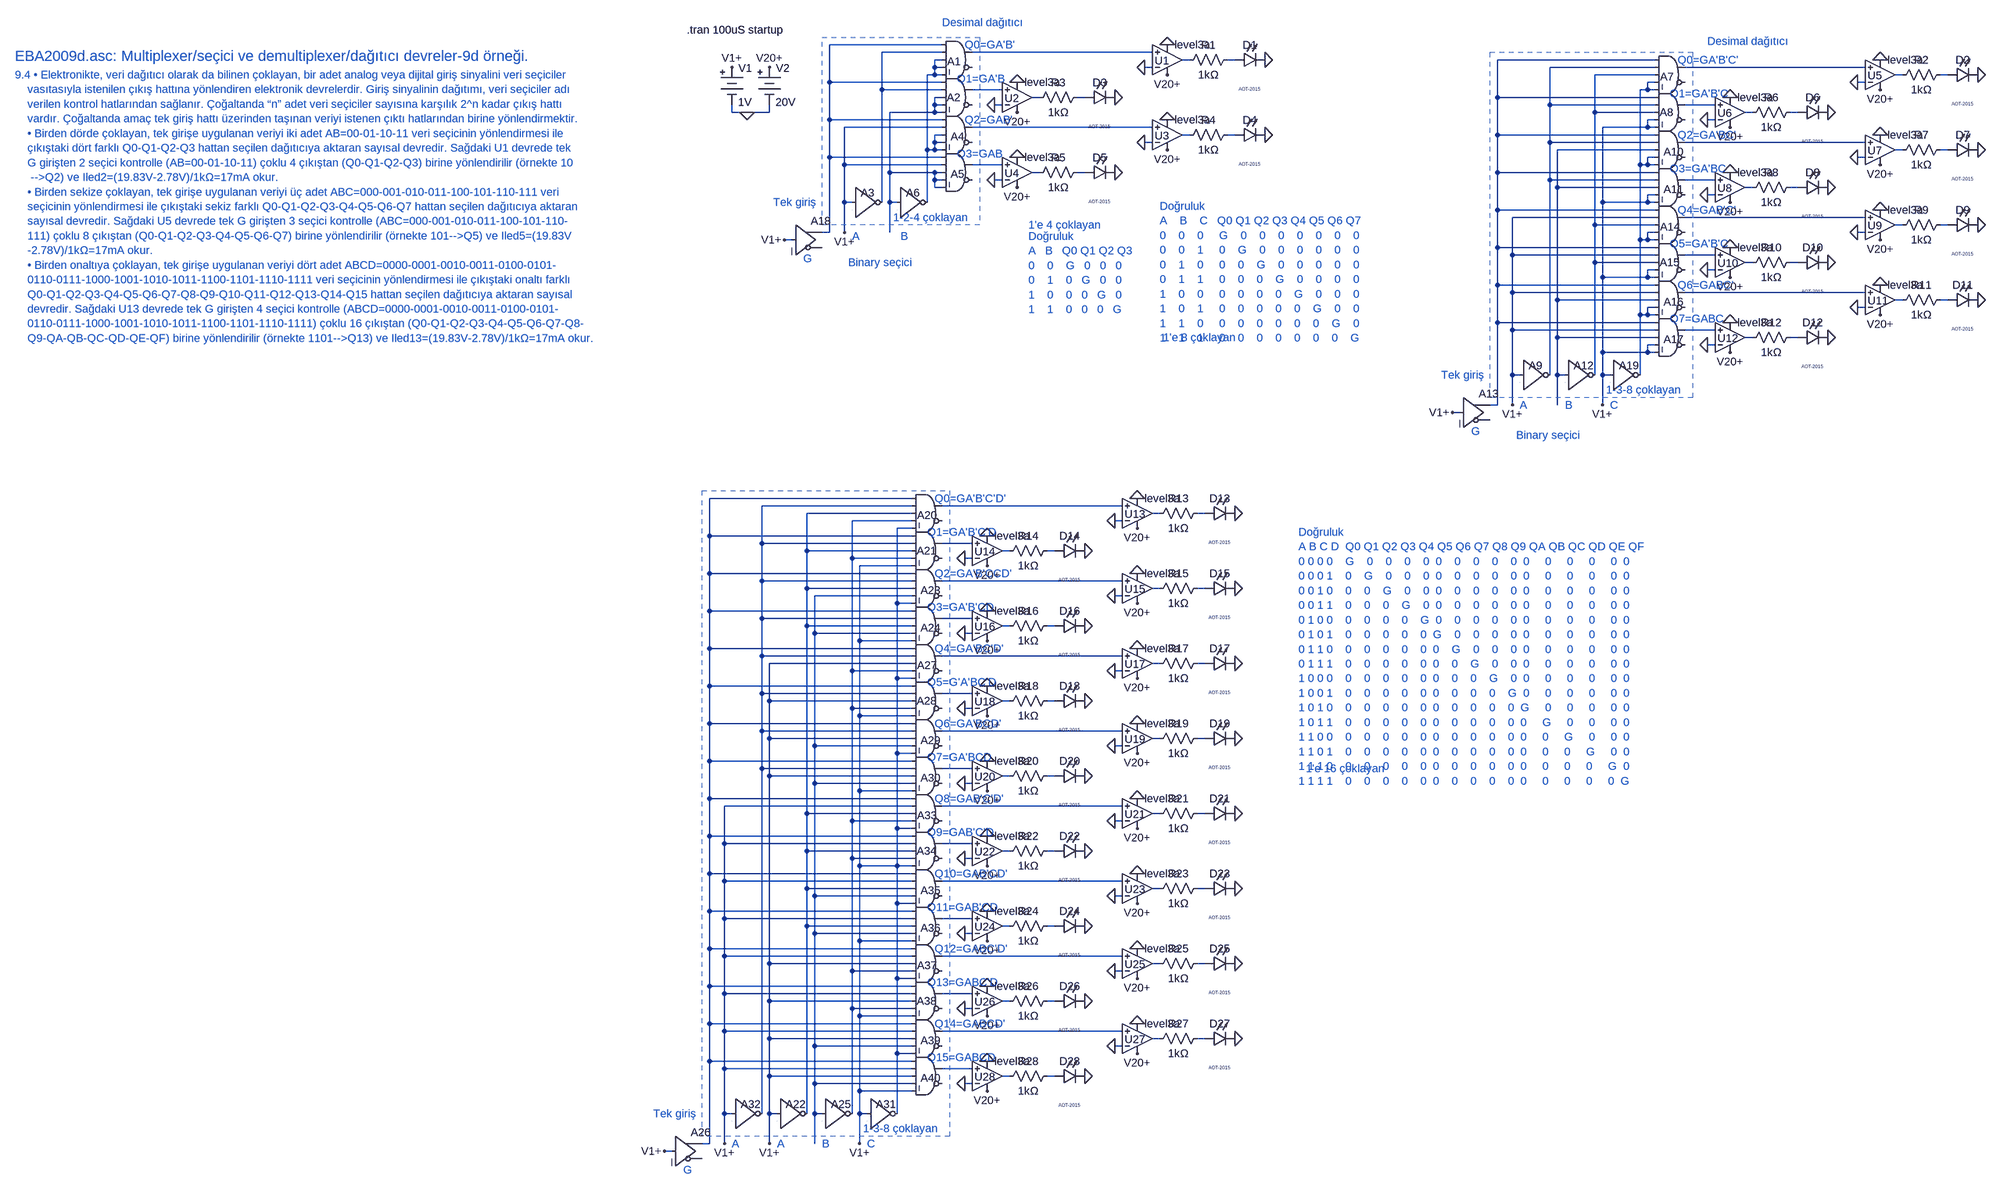
[diagram p0: schematic EBA2009d.asc]
EBA2009d.asc, the LTspice schematic file:
Version 4
SHEET 1 7064 4332
WIRE 1808 32 1568 32
WIRE 1808 48 1680 48
WIRE 2256 48 1872 48
WIRE 1808 64 1792 64
WIRE 2336 64 2320 64
WIRE 2432 64 2416 64
WIRE 3328 64 2992 64
WIRE 1792 80 1792 64
WIRE 1808 80 1792 80
WIRE 2256 80 2240 80
WIRE 3328 80 3104 80
WIRE 3776 80 3392 80
WIRE 1792 96 1792 80
WIRE 1792 96 1776 96
WIRE 1808 96 1792 96
WIRE 3328 96 3200 96
WIRE 3856 96 3840 96
WIRE 3952 96 3936 96
WIRE 1568 112 1568 32
WIRE 1808 112 1568 112
WIRE 3328 112 3312 112
WIRE 3776 112 3760 112
WIRE 1680 128 1680 48
WIRE 1808 128 1680 128
WIRE 1936 128 1872 128
WIRE 3312 128 3312 112
WIRE 3312 128 3296 128
WIRE 3328 128 3312 128
WIRE 1808 144 1792 144
WIRE 2016 144 2000 144
WIRE 2112 144 2096 144
WIRE 2992 144 2992 64
WIRE 3328 144 2992 144
WIRE 1792 160 1792 144
WIRE 1808 160 1792 160
WIRE 1936 160 1920 160
WIRE 3104 160 3104 80
WIRE 3328 160 3104 160
WIRE 3456 160 3392 160
WIRE 1360 176 1360 160
WIRE 1392 176 1360 176
WIRE 1440 176 1440 160
WIRE 1440 176 1392 176
WIRE 1792 176 1792 160
WIRE 1792 176 1696 176
WIRE 1808 176 1792 176
WIRE 3200 176 3200 96
WIRE 3328 176 3200 176
WIRE 3536 176 3520 176
WIRE 3632 176 3616 176
WIRE 1568 192 1568 112
WIRE 1808 192 1568 192
WIRE 3328 192 3312 192
WIRE 3456 192 3440 192
WIRE 1808 208 1600 208
WIRE 2256 208 1872 208
WIRE 3312 208 3312 192
WIRE 3312 208 3216 208
WIRE 3328 208 3312 208
WIRE 1808 224 1792 224
WIRE 2336 224 2320 224
WIRE 2432 224 2416 224
WIRE 2992 224 2992 144
WIRE 3328 224 2992 224
WIRE 1792 240 1792 224
WIRE 1808 240 1792 240
WIRE 2256 240 2240 240
WIRE 3104 240 3104 160
WIRE 3328 240 3104 240
WIRE 3776 240 3392 240
WIRE 1776 256 1776 96
WIRE 1792 256 1792 240
WIRE 1792 256 1776 256
WIRE 1808 256 1792 256
WIRE 3328 256 3120 256
WIRE 3856 256 3840 256
WIRE 3952 256 3936 256
WIRE 1568 272 1568 192
WIRE 1808 272 1568 272
WIRE 3328 272 3312 272
WIRE 3776 272 3760 272
WIRE 1600 288 1600 208
WIRE 1808 288 1600 288
WIRE 1936 288 1872 288
WIRE 3296 288 3296 128
WIRE 3312 288 3312 272
WIRE 3312 288 3296 288
WIRE 3328 288 3312 288
WIRE 1696 304 1696 176
WIRE 1792 304 1696 304
WIRE 1808 304 1792 304
WIRE 2016 304 2000 304
WIRE 2112 304 2096 304
WIRE 2992 304 2992 224
WIRE 3328 304 2992 304
WIRE 1792 320 1792 304
WIRE 1808 320 1792 320
WIRE 1936 320 1920 320
WIRE 3104 320 3104 240
WIRE 3328 320 3104 320
WIRE 3456 320 3392 320
WIRE 1792 336 1792 320
WIRE 1808 336 1792 336
WIRE 3120 336 3120 256
WIRE 3328 336 3120 336
WIRE 3536 336 3520 336
WIRE 3632 336 3616 336
WIRE 3328 352 3312 352
WIRE 3456 352 3440 352
WIRE 1600 368 1600 288
WIRE 1616 368 1600 368
WIRE 1680 368 1680 128
WIRE 1696 368 1696 304
WIRE 1712 368 1696 368
WIRE 1776 368 1776 256
WIRE 3216 368 3216 208
WIRE 3312 368 3312 352
WIRE 3312 368 3216 368
WIRE 3328 368 3312 368
WIRE 2992 384 2992 304
WIRE 3328 384 2992 384
WIRE 3328 400 3024 400
WIRE 3776 400 3392 400
WIRE 3200 416 3200 176
WIRE 3328 416 3200 416
WIRE 3856 416 3840 416
WIRE 3952 416 3936 416
WIRE 1568 432 1568 272
WIRE 1568 432 1552 432
WIRE 1600 432 1600 368
WIRE 1696 432 1696 368
WIRE 3328 432 3312 432
WIRE 3776 432 3760 432
WIRE 1488 448 1472 448
WIRE 3296 448 3296 288
WIRE 3312 448 3312 432
WIRE 3312 448 3296 448
WIRE 3328 448 3312 448
WIRE 2992 464 2992 384
WIRE 3328 464 2992 464
WIRE 3024 480 3024 400
WIRE 3328 480 3024 480
WIRE 3456 480 3392 480
WIRE 3200 496 3200 416
WIRE 3328 496 3200 496
WIRE 3536 496 3520 496
WIRE 3632 496 3616 496
WIRE 3328 512 3312 512
WIRE 3456 512 3440 512
WIRE 3216 528 3216 368
WIRE 3312 528 3312 512
WIRE 3312 528 3216 528
WIRE 3328 528 3312 528
WIRE 2992 544 2992 464
WIRE 3328 544 2992 544
WIRE 3024 560 3024 480
WIRE 3328 560 3024 560
WIRE 3776 560 3392 560
WIRE 3120 576 3120 336
WIRE 3328 576 3120 576
WIRE 3856 576 3840 576
WIRE 3952 576 3936 576
WIRE 3328 592 3312 592
WIRE 3776 592 3760 592
WIRE 3296 608 3296 448
WIRE 3312 608 3312 592
WIRE 3312 608 3296 608
WIRE 3328 608 3312 608
WIRE 2992 624 2992 544
WIRE 3328 624 2992 624
WIRE 3024 640 3024 560
WIRE 3328 640 3024 640
WIRE 3456 640 3392 640
WIRE 3120 656 3120 576
WIRE 3328 656 3120 656
WIRE 3536 656 3520 656
WIRE 3632 656 3616 656
WIRE 3328 672 3312 672
WIRE 3456 672 3440 672
WIRE 3216 688 3216 528
WIRE 3312 688 3312 672
WIRE 3312 688 3216 688
WIRE 3328 688 3312 688
WIRE 3024 736 3024 640
WIRE 3040 736 3024 736
WIRE 3104 736 3104 320
WIRE 3120 736 3120 656
WIRE 3136 736 3120 736
WIRE 3200 736 3200 496
WIRE 3216 736 3216 688
WIRE 3232 736 3216 736
WIRE 3296 736 3296 608
WIRE 2992 800 2992 624
WIRE 2992 800 2976 800
WIRE 3024 800 3024 736
WIRE 3120 800 3120 736
WIRE 3216 800 3216 736
WIRE 2912 816 2896 816
WIRE 1744 1024 1312 1024
WIRE 1744 1040 1424 1040
WIRE 2192 1040 1808 1040
WIRE 1744 1056 1520 1056
WIRE 2272 1056 2256 1056
WIRE 2368 1056 2352 1056
WIRE 1744 1072 1616 1072
WIRE 2192 1072 2176 1072
WIRE 1744 1088 1712 1088
WIRE 1312 1104 1312 1024
WIRE 1744 1104 1312 1104
WIRE 1424 1120 1424 1040
WIRE 1744 1120 1424 1120
WIRE 1872 1120 1808 1120
WIRE 1520 1136 1520 1056
WIRE 1744 1136 1520 1136
WIRE 1952 1136 1936 1136
WIRE 2048 1136 2032 1136
WIRE 1616 1152 1616 1072
WIRE 1744 1152 1616 1152
WIRE 1872 1152 1856 1152
WIRE 1744 1168 1632 1168
WIRE 1312 1184 1312 1104
WIRE 1744 1184 1312 1184
WIRE 1424 1200 1424 1120
WIRE 1744 1200 1424 1200
WIRE 2192 1200 1808 1200
WIRE 1520 1216 1520 1136
WIRE 1744 1216 1520 1216
WIRE 2272 1216 2256 1216
WIRE 2368 1216 2352 1216
WIRE 1744 1232 1536 1232
WIRE 2192 1232 2176 1232
WIRE 1712 1248 1712 1088
WIRE 1744 1248 1712 1248
WIRE 1312 1264 1312 1184
WIRE 1744 1264 1312 1264
WIRE 1424 1280 1424 1200
WIRE 1744 1280 1424 1280
WIRE 1872 1280 1808 1280
WIRE 1520 1296 1520 1216
WIRE 1744 1296 1520 1296
WIRE 1952 1296 1936 1296
WIRE 2048 1296 2032 1296
WIRE 1536 1312 1536 1232
WIRE 1744 1312 1536 1312
WIRE 1872 1312 1856 1312
WIRE 1632 1328 1632 1168
WIRE 1744 1328 1632 1328
WIRE 1312 1344 1312 1264
WIRE 1744 1344 1312 1344
WIRE 1424 1360 1424 1280
WIRE 1744 1360 1424 1360
WIRE 2192 1360 1808 1360
WIRE 1744 1376 1440 1376
WIRE 2272 1376 2256 1376
WIRE 2368 1376 2352 1376
WIRE 1616 1392 1616 1152
WIRE 1744 1392 1616 1392
WIRE 2192 1392 2176 1392
WIRE 1712 1408 1712 1248
WIRE 1744 1408 1712 1408
WIRE 1312 1424 1312 1344
WIRE 1744 1424 1312 1424
WIRE 1424 1440 1424 1360
WIRE 1744 1440 1424 1440
WIRE 1872 1440 1808 1440
WIRE 1440 1456 1440 1376
WIRE 1744 1456 1440 1456
WIRE 1952 1456 1936 1456
WIRE 2048 1456 2032 1456
WIRE 1616 1472 1616 1392
WIRE 1744 1472 1616 1472
WIRE 1872 1472 1856 1472
WIRE 1632 1488 1632 1328
WIRE 1744 1488 1632 1488
WIRE 1312 1504 1312 1424
WIRE 1744 1504 1312 1504
WIRE 1424 1520 1424 1440
WIRE 1744 1520 1424 1520
WIRE 2192 1520 1808 1520
WIRE 1440 1536 1440 1456
WIRE 1744 1536 1440 1536
WIRE 2272 1536 2256 1536
WIRE 2368 1536 2352 1536
WIRE 1536 1552 1536 1312
WIRE 1744 1552 1536 1552
WIRE 2192 1552 2176 1552
WIRE 1712 1568 1712 1408
WIRE 1744 1568 1712 1568
WIRE 1312 1584 1312 1504
WIRE 1744 1584 1312 1584
WIRE 1424 1600 1424 1520
WIRE 1744 1600 1424 1600
WIRE 1872 1600 1808 1600
WIRE 1440 1616 1440 1536
WIRE 1744 1616 1440 1616
WIRE 1952 1616 1936 1616
WIRE 2048 1616 2032 1616
WIRE 1536 1632 1536 1552
WIRE 1744 1632 1536 1632
WIRE 1872 1632 1856 1632
WIRE 1632 1648 1632 1488
WIRE 1744 1648 1632 1648
WIRE 1312 1664 1312 1584
WIRE 1744 1664 1312 1664
WIRE 1744 1680 1344 1680
WIRE 2192 1680 1808 1680
WIRE 1520 1696 1520 1296
WIRE 1744 1696 1520 1696
WIRE 2272 1696 2256 1696
WIRE 2368 1696 2352 1696
WIRE 1616 1712 1616 1472
WIRE 1744 1712 1616 1712
WIRE 2192 1712 2176 1712
WIRE 1712 1728 1712 1568
WIRE 1744 1728 1712 1728
WIRE 1312 1744 1312 1664
WIRE 1744 1744 1312 1744
WIRE 1344 1760 1344 1680
WIRE 1744 1760 1344 1760
WIRE 1872 1760 1808 1760
WIRE 1520 1776 1520 1696
WIRE 1744 1776 1520 1776
WIRE 1952 1776 1936 1776
WIRE 2048 1776 2032 1776
WIRE 1616 1792 1616 1712
WIRE 1744 1792 1616 1792
WIRE 1872 1792 1856 1792
WIRE 1632 1808 1632 1648
WIRE 1712 1808 1712 1728
WIRE 1712 1808 1632 1808
WIRE 1744 1808 1712 1808
WIRE 1312 1824 1312 1744
WIRE 1744 1824 1312 1824
WIRE 1344 1840 1344 1760
WIRE 1744 1840 1344 1840
WIRE 2192 1840 1808 1840
WIRE 1520 1856 1520 1776
WIRE 1744 1856 1520 1856
WIRE 2272 1856 2256 1856
WIRE 2368 1856 2352 1856
WIRE 1536 1872 1536 1632
WIRE 1744 1872 1536 1872
WIRE 2192 1872 2176 1872
WIRE 1712 1888 1712 1808
WIRE 1744 1888 1712 1888
WIRE 1312 1904 1312 1824
WIRE 1744 1904 1312 1904
WIRE 1344 1920 1344 1840
WIRE 1744 1920 1344 1920
WIRE 1872 1920 1808 1920
WIRE 1520 1936 1520 1856
WIRE 1744 1936 1520 1936
WIRE 1952 1936 1936 1936
WIRE 2048 1936 2032 1936
WIRE 1536 1952 1536 1872
WIRE 1744 1952 1536 1952
WIRE 1872 1952 1856 1952
WIRE 1632 1968 1632 1808
WIRE 1744 1968 1632 1968
WIRE 1312 1984 1312 1904
WIRE 1744 1984 1312 1984
WIRE 1344 2000 1344 1920
WIRE 1744 2000 1344 2000
WIRE 2192 2000 1808 2000
WIRE 1440 2016 1440 1616
WIRE 1744 2016 1440 2016
WIRE 2272 2016 2256 2016
WIRE 2368 2016 2352 2016
WIRE 1616 2032 1616 1792
WIRE 1744 2032 1616 2032
WIRE 2192 2032 2176 2032
WIRE 1712 2048 1712 1888
WIRE 1744 2048 1712 2048
WIRE 1312 2064 1312 1984
WIRE 1744 2064 1312 2064
WIRE 1344 2080 1344 2000
WIRE 1744 2080 1344 2080
WIRE 1872 2080 1808 2080
WIRE 1440 2096 1440 2016
WIRE 1744 2096 1440 2096
WIRE 1952 2096 1936 2096
WIRE 2048 2096 2032 2096
WIRE 1616 2112 1616 2032
WIRE 1744 2112 1616 2112
WIRE 1872 2112 1856 2112
WIRE 1632 2128 1632 1968
WIRE 1744 2128 1632 2128
WIRE 1312 2144 1312 2064
WIRE 1744 2144 1312 2144
WIRE 1344 2160 1344 2080
WIRE 1744 2160 1344 2160
WIRE 2192 2160 1808 2160
WIRE 1440 2176 1440 2096
WIRE 1744 2176 1440 2176
WIRE 2272 2176 2256 2176
WIRE 2368 2176 2352 2176
WIRE 1536 2192 1536 1952
WIRE 1744 2192 1536 2192
WIRE 2192 2192 2176 2192
WIRE 1712 2208 1712 2048
WIRE 1744 2208 1712 2208
WIRE 1312 2224 1312 2144
WIRE 1744 2224 1312 2224
WIRE 1344 2240 1344 2160
WIRE 1744 2240 1344 2240
WIRE 1872 2240 1808 2240
WIRE 1440 2256 1440 2176
WIRE 1744 2256 1440 2256
WIRE 1952 2256 1936 2256
WIRE 2048 2256 2032 2256
WIRE 1536 2272 1536 2192
WIRE 1744 2272 1536 2272
WIRE 1872 2272 1856 2272
WIRE 1632 2288 1632 2128
WIRE 1744 2288 1632 2288
WIRE 1344 2336 1344 2240
WIRE 1360 2336 1344 2336
WIRE 1424 2336 1424 1600
WIRE 1440 2336 1440 2256
WIRE 1456 2336 1440 2336
WIRE 1520 2336 1520 1936
WIRE 1536 2336 1536 2272
WIRE 1552 2336 1536 2336
WIRE 1616 2336 1616 2112
WIRE 1632 2336 1632 2288
WIRE 1648 2336 1632 2336
WIRE 1712 2336 1712 2208
WIRE 1312 2400 1312 2224
WIRE 1312 2400 1296 2400
WIRE 1344 2400 1344 2336
WIRE 1440 2400 1440 2336
WIRE 1536 2400 1536 2336
WIRE 1632 2400 1632 2336
WIRE 1232 2416 1216 2416
FLAG 2288 32 0
FLAG 2288 96 V20+
FLAG 2240 80 0
FLAG 2496 64 0
FLAG 1472 448 V1+
FLAG 1600 432 V1+
FLAG 1360 80 V1+
FLAG 1440 80 V20+
FLAG 1392 176 0
FLAG 1968 112 0
FLAG 1968 176 V20+
FLAG 1920 160 0
FLAG 2176 144 0
FLAG 2288 192 0
FLAG 2288 256 V20+
FLAG 2240 240 0
FLAG 2496 224 0
FLAG 1968 272 0
FLAG 1968 336 V20+
FLAG 1920 320 0
FLAG 2176 304 0
FLAG 3808 64 0
FLAG 3808 128 V20+
FLAG 3760 112 0
FLAG 4016 96 0
FLAG 2896 816 V1+
FLAG 3024 800 V1+
FLAG 3488 144 0
FLAG 3488 208 V20+
FLAG 3440 192 0
FLAG 3696 176 0
FLAG 3808 224 0
FLAG 3808 288 V20+
FLAG 3760 272 0
FLAG 4016 256 0
FLAG 3488 304 0
FLAG 3488 368 V20+
FLAG 3440 352 0
FLAG 3696 336 0
FLAG 3808 384 0
FLAG 3808 448 V20+
FLAG 3760 432 0
FLAG 4016 416 0
FLAG 3488 464 0
FLAG 3488 528 V20+
FLAG 3440 512 0
FLAG 3696 496 0
FLAG 3808 544 0
FLAG 3808 608 V20+
FLAG 3760 592 0
FLAG 4016 576 0
FLAG 3488 624 0
FLAG 3488 688 V20+
FLAG 3440 672 0
FLAG 3696 656 0
FLAG 3216 800 V1+
FLAG 2224 1024 0
FLAG 2224 1088 V20+
FLAG 2176 1072 0
FLAG 2432 1056 0
FLAG 1216 2416 V1+
FLAG 1440 2400 V1+
FLAG 1904 1104 0
FLAG 1904 1168 V20+
FLAG 1856 1152 0
FLAG 2112 1136 0
FLAG 2224 1184 0
FLAG 2224 1248 V20+
FLAG 2176 1232 0
FLAG 2432 1216 0
FLAG 1904 1264 0
FLAG 1904 1328 V20+
FLAG 1856 1312 0
FLAG 2112 1296 0
FLAG 2224 1344 0
FLAG 2224 1408 V20+
FLAG 2176 1392 0
FLAG 2432 1376 0
FLAG 1904 1424 0
FLAG 1904 1488 V20+
FLAG 1856 1472 0
FLAG 2112 1456 0
FLAG 2224 1504 0
FLAG 2224 1568 V20+
FLAG 2176 1552 0
FLAG 2432 1536 0
FLAG 1904 1584 0
FLAG 1904 1648 V20+
FLAG 1856 1632 0
FLAG 2112 1616 0
FLAG 1632 2400 V1+
FLAG 1344 2400 V1+
FLAG 2224 1664 0
FLAG 2224 1728 V20+
FLAG 2176 1712 0
FLAG 2432 1696 0
FLAG 1904 1744 0
FLAG 1904 1808 V20+
FLAG 1856 1792 0
FLAG 2112 1776 0
FLAG 2224 1824 0
FLAG 2224 1888 V20+
FLAG 2176 1872 0
FLAG 2432 1856 0
FLAG 1904 1904 0
FLAG 1904 1968 V20+
FLAG 1856 1952 0
FLAG 2112 1936 0
FLAG 2224 1984 0
FLAG 2224 2048 V20+
FLAG 2176 2032 0
FLAG 2432 2016 0
FLAG 1904 2064 0
FLAG 1904 2128 V20+
FLAG 1856 2112 0
FLAG 2112 2096 0
FLAG 2224 2144 0
FLAG 2224 2208 V20+
FLAG 2176 2192 0
FLAG 2432 2176 0
FLAG 1904 2224 0
FLAG 1904 2288 V20+
FLAG 1856 2272 0
FLAG 2112 2256 0
SYMBOL Digital\\and 1840 0 R0
WINDOW 0 -21 68 Left 2
SYMATTR InstName A1
SYMBOL Digital\\and 1840 80 R0
WINDOW 0 -22 64 Left 2
SYMATTR InstName A2
SYMBOL Digital\\inv 1616 304 R0
WINDOW 0 19 44 Left 2
SYMATTR InstName A3
SYMBOL Digital\\and 1840 160 R0
WINDOW 0 -14 68 Left 2
SYMATTR InstName A4
SYMBOL Digital\\and 1840 240 R0
WINDOW 0 -14 68 Left 2
SYMATTR InstName A5
SYMBOL Digital\\inv 1712 304 R0
WINDOW 0 19 44 Left 2
SYMATTR InstName A6
SYMBOL OpAmps\\UniversalOpAmp3 2288 64 M180
WINDOW 0 -27 -2 Left 2
SYMATTR InstName U1
SYMBOL res 2432 48 R90
WINDOW 0 0 56 VBottom 2
WINDOW 3 32 56 VTop 2
SYMATTR InstName R1
SYMATTR Value 1kΩ
SYMBOL LED 2432 48 M90
WINDOW 0 0 32 VBottom 2
WINDOW 3 72 32 VTop 0
SYMATTR InstName D1
SYMATTR Value AOT-2015
SYMATTR Description Diode
SYMATTR Type diode
SYMBOL Misc\\battery 1360 64 R0
WINDOW 0 14 18 Left 2
WINDOW 3 13 90 Left 2
SYMATTR InstName V1
SYMATTR Value 1V
SYMBOL Misc\\battery 1440 64 R0
WINDOW 0 14 18 Left 2
WINDOW 3 13 90 Left 2
SYMATTR InstName V2
SYMATTR Value 20V
SYMBOL OpAmps\\UniversalOpAmp3 1968 144 M180
WINDOW 0 -27 -2 Left 2
SYMATTR InstName U2
SYMBOL res 2112 128 R90
WINDOW 0 0 56 VBottom 2
WINDOW 3 32 56 VTop 2
SYMATTR InstName R3
SYMATTR Value 1kΩ
SYMBOL LED 2112 128 M90
WINDOW 0 0 32 VBottom 2
WINDOW 3 72 32 VTop 0
SYMATTR InstName D3
SYMATTR Value AOT-2015
SYMATTR Description Diode
SYMATTR Type diode
SYMBOL OpAmps\\UniversalOpAmp3 2288 224 M180
WINDOW 0 -27 -2 Left 2
SYMATTR InstName U3
SYMBOL res 2432 208 R90
WINDOW 0 0 56 VBottom 2
WINDOW 3 32 56 VTop 2
SYMATTR InstName R4
SYMATTR Value 1kΩ
SYMBOL LED 2432 208 M90
WINDOW 0 0 32 VBottom 2
WINDOW 3 72 32 VTop 0
SYMATTR InstName D4
SYMATTR Value AOT-2015
SYMATTR Description Diode
SYMATTR Type diode
SYMBOL OpAmps\\UniversalOpAmp3 1968 304 M180
WINDOW 0 -27 -2 Left 2
SYMATTR InstName U4
SYMBOL res 2112 288 R90
WINDOW 0 0 56 VBottom 2
WINDOW 3 32 56 VTop 2
SYMATTR InstName R5
SYMATTR Value 1kΩ
SYMBOL LED 2112 288 M90
WINDOW 0 0 32 VBottom 2
WINDOW 3 72 32 VTop 0
SYMATTR InstName D5
SYMATTR Value AOT-2015
SYMATTR Description Diode
SYMATTR Type diode
SYMBOL Digital\\buf 1488 384 R0
SYMATTR InstName A18
SYMBOL Digital\\and 3360 32 R0
WINDOW 0 -21 68 Left 2
SYMATTR InstName A7
SYMBOL Digital\\and 3360 112 R0
WINDOW 0 -22 64 Left 2
SYMATTR InstName A8
SYMBOL Digital\\inv 3040 672 R0
WINDOW 0 19 44 Left 2
SYMATTR InstName A9
SYMBOL Digital\\and 3360 192 R0
WINDOW 0 -14 68 Left 2
SYMATTR InstName A10
SYMBOL Digital\\and 3360 272 R0
WINDOW 0 -14 68 Left 2
SYMATTR InstName A11
SYMBOL Digital\\inv 3136 672 R0
WINDOW 0 19 44 Left 2
SYMATTR InstName A12
SYMBOL OpAmps\\UniversalOpAmp3 3808 96 M180
WINDOW 0 -27 -2 Left 2
SYMATTR InstName U5
SYMBOL res 3952 80 R90
WINDOW 0 0 56 VBottom 2
WINDOW 3 32 56 VTop 2
SYMATTR InstName R2
SYMATTR Value 1kΩ
SYMBOL LED 3952 80 M90
WINDOW 0 0 32 VBottom 2
WINDOW 3 72 32 VTop 0
SYMATTR InstName D2
SYMATTR Value AOT-2015
SYMATTR Description Diode
SYMATTR Type diode
SYMBOL OpAmps\\UniversalOpAmp3 3488 176 M180
WINDOW 0 -27 -2 Left 2
SYMATTR InstName U6
SYMBOL res 3632 160 R90
WINDOW 0 0 56 VBottom 2
WINDOW 3 32 56 VTop 2
SYMATTR InstName R6
SYMATTR Value 1kΩ
SYMBOL LED 3632 160 M90
WINDOW 0 0 32 VBottom 2
WINDOW 3 72 32 VTop 0
SYMATTR InstName D6
SYMATTR Value AOT-2015
SYMATTR Description Diode
SYMATTR Type diode
SYMBOL OpAmps\\UniversalOpAmp3 3808 256 M180
WINDOW 0 -27 -2 Left 2
SYMATTR InstName U7
SYMBOL res 3952 240 R90
WINDOW 0 0 56 VBottom 2
WINDOW 3 32 56 VTop 2
SYMATTR InstName R7
SYMATTR Value 1kΩ
SYMBOL LED 3952 240 M90
WINDOW 0 0 32 VBottom 2
WINDOW 3 72 32 VTop 0
SYMATTR InstName D7
SYMATTR Value AOT-2015
SYMATTR Description Diode
SYMATTR Type diode
SYMBOL OpAmps\\UniversalOpAmp3 3488 336 M180
WINDOW 0 -27 -2 Left 2
SYMATTR InstName U8
SYMBOL res 3632 320 R90
WINDOW 0 0 56 VBottom 2
WINDOW 3 32 56 VTop 2
SYMATTR InstName R8
SYMATTR Value 1kΩ
SYMBOL LED 3632 320 M90
WINDOW 0 0 32 VBottom 2
WINDOW 3 72 32 VTop 0
SYMATTR InstName D8
SYMATTR Value AOT-2015
SYMATTR Description Diode
SYMATTR Type diode
SYMBOL Digital\\buf 2912 752 R0
SYMATTR InstName A13
SYMBOL Digital\\and 3360 352 R0
WINDOW 0 -21 68 Left 2
SYMATTR InstName A14
SYMBOL Digital\\and 3360 432 R0
WINDOW 0 -22 64 Left 2
SYMATTR InstName A15
SYMBOL Digital\\and 3360 512 R0
WINDOW 0 -14 68 Left 2
SYMATTR InstName A16
SYMBOL Digital\\and 3360 592 R0
WINDOW 0 -14 68 Left 2
SYMATTR InstName A17
SYMBOL OpAmps\\UniversalOpAmp3 3808 416 M180
WINDOW 0 -27 -2 Left 2
SYMATTR InstName U9
SYMBOL res 3952 400 R90
WINDOW 0 0 56 VBottom 2
WINDOW 3 32 56 VTop 2
SYMATTR InstName R9
SYMATTR Value 1kΩ
SYMBOL LED 3952 400 M90
WINDOW 0 0 32 VBottom 2
WINDOW 3 72 32 VTop 0
SYMATTR InstName D9
SYMATTR Value AOT-2015
SYMATTR Description Diode
SYMATTR Type diode
SYMBOL OpAmps\\UniversalOpAmp3 3488 496 M180
WINDOW 0 -27 -2 Left 2
SYMATTR InstName U10
SYMBOL res 3632 480 R90
WINDOW 0 0 56 VBottom 2
WINDOW 3 32 56 VTop 2
SYMATTR InstName R10
SYMATTR Value 1kΩ
SYMBOL LED 3632 480 M90
WINDOW 0 0 32 VBottom 2
WINDOW 3 72 32 VTop 0
SYMATTR InstName D10
SYMATTR Value AOT-2015
SYMATTR Description Diode
SYMATTR Type diode
SYMBOL OpAmps\\UniversalOpAmp3 3808 576 M180
WINDOW 0 -27 -2 Left 2
SYMATTR InstName U11
SYMBOL res 3952 560 R90
WINDOW 0 0 56 VBottom 2
WINDOW 3 32 56 VTop 2
SYMATTR InstName R11
SYMATTR Value 1kΩ
SYMBOL LED 3952 560 M90
WINDOW 0 0 32 VBottom 2
WINDOW 3 72 32 VTop 0
SYMATTR InstName D11
SYMATTR Value AOT-2015
SYMATTR Description Diode
SYMATTR Type diode
SYMBOL OpAmps\\UniversalOpAmp3 3488 656 M180
WINDOW 0 -27 -2 Left 2
SYMATTR InstName U12
SYMBOL res 3632 640 R90
WINDOW 0 0 56 VBottom 2
WINDOW 3 32 56 VTop 2
SYMATTR InstName R12
SYMATTR Value 1kΩ
SYMBOL LED 3632 640 M90
WINDOW 0 0 32 VBottom 2
WINDOW 3 72 32 VTop 0
SYMATTR InstName D12
SYMATTR Value AOT-2015
SYMATTR Description Diode
SYMATTR Type diode
SYMBOL Digital\\inv 3232 672 R0
WINDOW 0 19 44 Left 2
SYMATTR InstName A19
SYMBOL Digital\\and 1776 992 R0
WINDOW 0 -21 68 Left 2
SYMATTR InstName A20
SYMBOL Digital\\and 1776 1072 R0
WINDOW 0 -22 64 Left 2
SYMATTR InstName A21
SYMBOL Digital\\inv 1456 2272 R0
WINDOW 0 19 44 Left 2
SYMATTR InstName A22
SYMBOL Digital\\and 1776 1152 R0
WINDOW 0 -14 68 Left 2
SYMATTR InstName A23
SYMBOL Digital\\and 1776 1232 R0
WINDOW 0 -14 68 Left 2
SYMATTR InstName A24
SYMBOL Digital\\inv 1552 2272 R0
WINDOW 0 19 44 Left 2
SYMATTR InstName A25
SYMBOL OpAmps\\UniversalOpAmp3 2224 1056 M180
WINDOW 0 -27 -2 Left 2
SYMATTR InstName U13
SYMBOL res 2368 1040 R90
WINDOW 0 0 56 VBottom 2
WINDOW 3 32 56 VTop 2
SYMATTR InstName R13
SYMATTR Value 1kΩ
SYMBOL LED 2368 1040 M90
WINDOW 0 0 32 VBottom 2
WINDOW 3 72 32 VTop 0
SYMATTR InstName D13
SYMATTR Value AOT-2015
SYMATTR Description Diode
SYMATTR Type diode
SYMBOL OpAmps\\UniversalOpAmp3 1904 1136 M180
WINDOW 0 -27 -2 Left 2
SYMATTR InstName U14
SYMBOL res 2048 1120 R90
WINDOW 0 0 56 VBottom 2
WINDOW 3 32 56 VTop 2
SYMATTR InstName R14
SYMATTR Value 1kΩ
SYMBOL LED 2048 1120 M90
WINDOW 0 0 32 VBottom 2
WINDOW 3 72 32 VTop 0
SYMATTR InstName D14
SYMATTR Value AOT-2015
SYMATTR Description Diode
SYMATTR Type diode
SYMBOL OpAmps\\UniversalOpAmp3 2224 1216 M180
WINDOW 0 -27 -2 Left 2
SYMATTR InstName U15
SYMBOL res 2368 1200 R90
WINDOW 0 0 56 VBottom 2
WINDOW 3 32 56 VTop 2
SYMATTR InstName R15
SYMATTR Value 1kΩ
SYMBOL LED 2368 1200 M90
WINDOW 0 0 32 VBottom 2
WINDOW 3 72 32 VTop 0
SYMATTR InstName D15
SYMATTR Value AOT-2015
SYMATTR Description Diode
SYMATTR Type diode
SYMBOL OpAmps\\UniversalOpAmp3 1904 1296 M180
WINDOW 0 -27 -2 Left 2
SYMATTR InstName U16
SYMBOL res 2048 1280 R90
WINDOW 0 0 56 VBottom 2
WINDOW 3 32 56 VTop 2
SYMATTR InstName R16
SYMATTR Value 1kΩ
SYMBOL LED 2048 1280 M90
WINDOW 0 0 32 VBottom 2
WINDOW 3 72 32 VTop 0
SYMATTR InstName D16
SYMATTR Value AOT-2015
SYMATTR Description Diode
SYMATTR Type diode
SYMBOL Digital\\buf 1232 2352 R0
SYMATTR InstName A26
SYMBOL Digital\\and 1776 1312 R0
WINDOW 0 -21 68 Left 2
SYMATTR InstName A27
SYMBOL Digital\\and 1776 1392 R0
WINDOW 0 -22 64 Left 2
SYMATTR InstName A28
SYMBOL Digital\\and 1776 1472 R0
WINDOW 0 -14 68 Left 2
SYMATTR InstName A29
SYMBOL Digital\\and 1776 1552 R0
WINDOW 0 -14 68 Left 2
SYMATTR InstName A30
SYMBOL OpAmps\\UniversalOpAmp3 2224 1376 M180
WINDOW 0 -27 -2 Left 2
SYMATTR InstName U17
SYMBOL res 2368 1360 R90
WINDOW 0 0 56 VBottom 2
WINDOW 3 32 56 VTop 2
SYMATTR InstName R17
SYMATTR Value 1kΩ
SYMBOL LED 2368 1360 M90
WINDOW 0 0 32 VBottom 2
WINDOW 3 72 32 VTop 0
SYMATTR InstName D17
SYMATTR Value AOT-2015
SYMATTR Description Diode
SYMATTR Type diode
SYMBOL OpAmps\\UniversalOpAmp3 1904 1456 M180
WINDOW 0 -27 -2 Left 2
SYMATTR InstName U18
SYMBOL res 2048 1440 R90
WINDOW 0 0 56 VBottom 2
WINDOW 3 32 56 VTop 2
SYMATTR InstName R18
SYMATTR Value 1kΩ
SYMBOL LED 2048 1440 M90
WINDOW 0 0 32 VBottom 2
WINDOW 3 72 32 VTop 0
SYMATTR InstName D18
SYMATTR Value AOT-2015
SYMATTR Description Diode
SYMATTR Type diode
SYMBOL OpAmps\\UniversalOpAmp3 2224 1536 M180
WINDOW 0 -27 -2 Left 2
SYMATTR InstName U19
SYMBOL res 2368 1520 R90
WINDOW 0 0 56 VBottom 2
WINDOW 3 32 56 VTop 2
SYMATTR InstName R19
SYMATTR Value 1kΩ
SYMBOL LED 2368 1520 M90
WINDOW 0 0 32 VBottom 2
WINDOW 3 72 32 VTop 0
SYMATTR InstName D19
SYMATTR Value AOT-2015
SYMATTR Description Diode
SYMATTR Type diode
SYMBOL OpAmps\\UniversalOpAmp3 1904 1616 M180
WINDOW 0 -27 -2 Left 2
SYMATTR InstName U20
SYMBOL res 2048 1600 R90
WINDOW 0 0 56 VBottom 2
WINDOW 3 32 56 VTop 2
SYMATTR InstName R20
SYMATTR Value 1kΩ
SYMBOL LED 2048 1600 M90
WINDOW 0 0 32 VBottom 2
WINDOW 3 72 32 VTop 0
SYMATTR InstName D20
SYMATTR Value AOT-2015
SYMATTR Description Diode
SYMATTR Type diode
SYMBOL Digital\\inv 1648 2272 R0
WINDOW 0 19 44 Left 2
SYMATTR InstName A31
SYMBOL Digital\\inv 1360 2272 R0
WINDOW 0 19 44 Left 2
SYMATTR InstName A32
SYMBOL Digital\\and 1776 1632 R0
WINDOW 0 -21 68 Left 2
SYMATTR InstName A33
SYMBOL Digital\\and 1776 1712 R0
WINDOW 0 -22 64 Left 2
SYMATTR InstName A34
SYMBOL Digital\\and 1776 1792 R0
WINDOW 0 -14 68 Left 2
SYMATTR InstName A35
SYMBOL Digital\\and 1776 1872 R0
WINDOW 0 -14 68 Left 2
SYMATTR InstName A36
SYMBOL OpAmps\\UniversalOpAmp3 2224 1696 M180
WINDOW 0 -27 -2 Left 2
SYMATTR InstName U21
SYMBOL res 2368 1680 R90
WINDOW 0 0 56 VBottom 2
WINDOW 3 32 56 VTop 2
SYMATTR InstName R21
SYMATTR Value 1kΩ
SYMBOL LED 2368 1680 M90
WINDOW 0 0 32 VBottom 2
WINDOW 3 72 32 VTop 0
SYMATTR InstName D21
SYMATTR Value AOT-2015
SYMATTR Description Diode
SYMATTR Type diode
SYMBOL OpAmps\\UniversalOpAmp3 1904 1776 M180
WINDOW 0 -27 -2 Left 2
SYMATTR InstName U22
SYMBOL res 2048 1760 R90
WINDOW 0 0 56 VBottom 2
WINDOW 3 32 56 VTop 2
SYMATTR InstName R22
SYMATTR Value 1kΩ
SYMBOL LED 2048 1760 M90
WINDOW 0 0 32 VBottom 2
WINDOW 3 72 32 VTop 0
SYMATTR InstName D22
SYMATTR Value AOT-2015
SYMATTR Description Diode
SYMATTR Type diode
SYMBOL OpAmps\\UniversalOpAmp3 2224 1856 M180
WINDOW 0 -27 -2 Left 2
SYMATTR InstName U23
SYMBOL res 2368 1840 R90
WINDOW 0 0 56 VBottom 2
WINDOW 3 32 56 VTop 2
SYMATTR InstName R23
SYMATTR Value 1kΩ
SYMBOL LED 2368 1840 M90
WINDOW 0 0 32 VBottom 2
WINDOW 3 72 32 VTop 0
SYMATTR InstName D23
SYMATTR Value AOT-2015
SYMATTR Description Diode
SYMATTR Type diode
SYMBOL OpAmps\\UniversalOpAmp3 1904 1936 M180
WINDOW 0 -27 -2 Left 2
SYMATTR InstName U24
SYMBOL res 2048 1920 R90
WINDOW 0 0 56 VBottom 2
WINDOW 3 32 56 VTop 2
SYMATTR InstName R24
SYMATTR Value 1kΩ
SYMBOL LED 2048 1920 M90
WINDOW 0 0 32 VBottom 2
WINDOW 3 72 32 VTop 0
SYMATTR InstName D24
SYMATTR Value AOT-2015
SYMATTR Description Diode
SYMATTR Type diode
SYMBOL Digital\\and 1776 1952 R0
WINDOW 0 -21 68 Left 2
SYMATTR InstName A37
SYMBOL Digital\\and 1776 2032 R0
WINDOW 0 -22 64 Left 2
SYMATTR InstName A38
SYMBOL Digital\\and 1776 2112 R0
WINDOW 0 -14 68 Left 2
SYMATTR InstName A39
SYMBOL Digital\\and 1776 2192 R0
WINDOW 0 -14 68 Left 2
SYMATTR InstName A40
SYMBOL OpAmps\\UniversalOpAmp3 2224 2016 M180
WINDOW 0 -27 -2 Left 2
SYMATTR InstName U25
SYMBOL res 2368 2000 R90
WINDOW 0 0 56 VBottom 2
WINDOW 3 32 56 VTop 2
SYMATTR InstName R25
SYMATTR Value 1kΩ
SYMBOL LED 2368 2000 M90
WINDOW 0 0 32 VBottom 2
WINDOW 3 72 32 VTop 0
SYMATTR InstName D25
SYMATTR Value AOT-2015
SYMATTR Description Diode
SYMATTR Type diode
SYMBOL OpAmps\\UniversalOpAmp3 1904 2096 M180
WINDOW 0 -27 -2 Left 2
SYMATTR InstName U26
SYMBOL res 2048 2080 R90
WINDOW 0 0 56 VBottom 2
WINDOW 3 32 56 VTop 2
SYMATTR InstName R26
SYMATTR Value 1kΩ
SYMBOL LED 2048 2080 M90
WINDOW 0 0 32 VBottom 2
WINDOW 3 72 32 VTop 0
SYMATTR InstName D26
SYMATTR Value AOT-2015
SYMATTR Description Diode
SYMATTR Type diode
SYMBOL OpAmps\\UniversalOpAmp3 2224 2176 M180
WINDOW 0 -27 -2 Left 2
SYMATTR InstName U27
SYMBOL res 2368 2160 R90
WINDOW 0 0 56 VBottom 2
WINDOW 3 32 56 VTop 2
SYMATTR InstName R27
SYMATTR Value 1kΩ
SYMBOL LED 2368 2160 M90
WINDOW 0 0 32 VBottom 2
WINDOW 3 72 32 VTop 0
SYMATTR InstName D27
SYMATTR Value AOT-2015
SYMATTR Description Diode
SYMATTR Type diode
SYMBOL OpAmps\\UniversalOpAmp3 1904 2256 M180
WINDOW 0 -27 -2 Left 2
SYMATTR InstName U28
SYMBOL res 2048 2240 R90
WINDOW 0 0 56 VBottom 2
WINDOW 3 32 56 VTop 2
SYMATTR InstName R28
SYMATTR Value 1kΩ
SYMBOL LED 2048 2240 M90
WINDOW 0 0 32 VBottom 2
WINDOW 3 72 32 VTop 0
SYMATTR InstName D28
SYMATTR Value AOT-2015
SYMATTR Description Diode
SYMATTR Type diode
TEXT -232 56 Left 3 ;EBA2009d.asc: Multiplexer/seçici ve demultiplexer/dağıtıcı devreler-9d örneği.
TEXT -232 96 Left 2 ;9.4 • Elektronikte, veri dağıtıcı olarak da bilinen çoklayan, bir adet analog veya dijital giriş sinyalini veri seçiciler \n    vasıtasıyla istenilen çıkış hattına yönlendiren elektronik devrelerdir. Giriş sinyalinin dağıtımı, veri seçiciler adı\n    verilen kontrol hatlarından sağlanır. Çoğaltanda “n” adet veri seçiciler sayısına karşılık 2^n kadar çıkış hattı \n    vardır. Çoğaltanda amaç tek giriş hattı üzerinden taşınan veriyi istenen çıktı hatlarından birine yönlendirmektir.\n    • Birden dörde çoklayan, tek girişe uygulanan veriyi iki adet AB=00-01-10-11 veri seçicinin yönlendirmesi ile \n    çıkıştaki dört farklı Q0-Q1-Q2-Q3 hattan seçilen dağıtıcıya aktaran sayısal devredir. Sağdaki U1 devrede tek\n    G girişten 2 seçici kontrolle (AB=00-01-10-11) çoklu 4 çıkıştan (Q0-Q1-Q2-Q3) birine yönlendirilir (örnekte 10\n     -->Q2) ve Iled2=(19.83V-2.78V)/1kΩ=17mA okur.\n    • Birden sekize çoklayan, tek girişe uygulanan veriyi üç adet ABC=000-001-010-011-100-101-110-111 veri \n    seçicinin yönlendirmesi ile çıkıştaki sekiz farklı Q0-Q1-Q2-Q3-Q4-Q5-Q6-Q7 hattan seçilen dağıtıcıya aktaran \n    sayısal devredir. Sağdaki U5 devrede tek G girişten 3 seçici kontrolle (ABC=000-001-010-011-100-101-110-\n    111) çoklu 8 çıkıştan (Q0-Q1-Q2-Q3-Q4-Q5-Q6-Q7) birine yönlendirilir (örnekte 101-->Q5) ve Iled5=(19.83V\n    -2.78V)/1kΩ=17mA okur.\n    • Birden onaltıya çoklayan, tek girişe uygulanan veriyi dört adet ABCD=0000-0001-0010-0011-0100-0101-\n    0110-0111-1000-1001-1010-1011-1100-1101-1110-1111 veri seçicinin yönlendirmesi ile çıkıştaki onaltı farklı\n    Q0-Q1-Q2-Q3-Q4-Q5-Q6-Q7-Q8-Q9-Q10-Q11-Q12-Q13-Q14-Q15 hattan seçilen dağıtıcıya aktaran sayısal \n    devredir. Sağdaki U13 devrede tek G girişten 4 seçici kontrolle (ABCD=0000-0001-0010-0011-0100-0101-\n    0110-0111-1000-1001-1010-1011-1100-1101-1110-1111) çoklu 16 çıkıştan (Q0-Q1-Q2-Q3-Q4-Q5-Q6-Q7-Q8-\n    Q9-QA-QB-QC-QD-QE-QF) birine yönlendirilir (örnekte 1101-->Q13) ve Iled13=(19.83V-2.78V)/1kΩ=17mA okur.
TEXT 1992 416 Left 2 ;1'e 4 çoklayan
TEXT 1992 440 Left 2 ;Doğruluk\nA   B   Q0 Q1 Q2 Q3\n0    0    G   0   0   0\n0    1    0   G   0   0\n1    0    0   0   G   0\n1    1    0   0   0   G
TEXT 1616 440 Left 2 ;A
TEXT 1704 400 Left 2 ;1-2-4 çoklayan
TEXT 1720 440 Left 2 ;B
TEXT 1512 488 Left 2 ;G
TEXT 1840 264 Left 2 ;Q3=GAB
TEXT 1856 192 Left 2 ;Q2=GAB'
TEXT 1840 104 Left 2 ;Q1=GA'B
TEXT 1856 32 Left 2 ;Q0=GA'B'
TEXT 2280 656 Left 2 ;1'e 8 çoklayan
TEXT 2272 376 Left 2 ;Doğruluk\nA    B    C   Q0 Q1 Q2 Q3 Q4 Q5 Q6 Q7\n0    0    0     G    0    0    0    0    0    0    0\n0    0    1     0    G    0    0    0    0    0    0\n0    1    0     0    0    G    0    0    0    0    0\n0    1    1     0    0    0    G    0    0    0    0\n1    0    0     0    0    0    0    G    0    0    0\n1    0    1     0    0    0    0    0    G    0    0\n1    1    0     0    0    0    0    0    0    G    0\n1    1    1     0    0    0    0    0    0    0    G
TEXT 1608 496 Left 2 ;Binary seçici
TEXT 1808 -16 Left 2 ;Desimal dağıtıcı
TEXT 1448 368 Left 2 ;Tek giriş
TEXT 1264 0 Left 2 !.tran 100uS startup
TEXT 3040 800 Left 2 ;A
TEXT 3224 768 Left 2 ;1-3-8 çoklayan
TEXT 3136 800 Left 2 ;B
TEXT 2936 856 Left 2 ;G
TEXT 3360 296 Left 2 ;Q3=GA'BC
TEXT 3376 224 Left 2 ;Q2=GA'BC'
TEXT 3360 136 Left 2 ;Q1=GA'B'C
TEXT 3376 64 Left 2 ;Q0=GA'B'C'
TEXT 3032 864 Left 2 ;Binary seçici
TEXT 3440 24 Left 2 ;Desimal dağıtıcı
TEXT 2872 736 Left 2 ;Tek giriş
TEXT 3360 616 Left 2 ;Q7=GABC
TEXT 3376 544 Left 2 ;Q6=GABC'
TEXT 3360 456 Left 2 ;Q5=GA'B'C
TEXT 3376 384 Left 2 ;Q4=GAB'C'
TEXT 3232 800 Left 2 ;C
TEXT 1456 2400 Left 2 ;A
TEXT 1640 2368 Left 2 ;1-3-8 çoklayan
TEXT 1552 2400 Left 2 ;B
TEXT 1256 2456 Left 2 ;G
TEXT 1776 1256 Left 2 ;Q3=GA'B'CD
TEXT 1792 1184 Left 2 ;Q2=GA'B'CCD'
TEXT 1776 1096 Left 2 ;Q1=GA'B'C'D
TEXT 1792 1024 Left 2 ;Q0=GA'B'C'D'
TEXT 1192 2336 Left 2 ;Tek giriş
TEXT 1776 1576 Left 2 ;Q7=GA'BCD
TEXT 1792 1504 Left 2 ;Q6=GA'BCD'
TEXT 1776 1416 Left 2 ;Q5=G'A'BC'D
TEXT 1792 1344 Left 2 ;Q4=GA'BC'D'
TEXT 1648 2400 Left 2 ;C
TEXT 2584 1600 Left 2 ;1'e 16 çoklayan
TEXT 2568 1096 Left 2 ;Doğruluk\nA B C D  Q0 Q1 Q2 Q3 Q4 Q5 Q6 Q7 Q8 Q9 QA QB QC QD QE QF\n0 0 0 0    G    0    0    0    0  0    0    0    0    0  0     0     0     0     0  0\n0 0 0 1    0    G    0    0    0  0    0    0    0    0  0     0     0     0     0  0\n0 0 1 0    0    0    G    0    0  0    0    0    0    0  0     0     0     0     0  0\n0 0 1 1    0    0    0    G    0  0    0    0    0    0  0     0     0     0     0  0\n0 1 0 0    0    0    0    0    G  0    0    0    0    0  0     0     0     0     0  0\n0 1 0 1    0    0    0    0    0  G    0    0    0    0  0     0     0     0     0  0\n0 1 1 0    0    0    0    0    0  0    G    0    0    0  0     0     0     0     0  0\n0 1 1 1    0    0    0    0    0  0    0    G    0    0  0     0     0     0     0  0\n1 0 0 0    0    0    0    0    0  0    0    0    G    0  0     0     0     0     0  0\n1 0 0 1    0    0    0    0    0  0    0    0    0    G  0     0     0     0     0  0\n1 0 1 0    0    0    0    0    0  0    0    0    0    0  G     0     0     0     0  0\n1 0 1 1    0    0    0    0    0  0    0    0    0    0  0     G     0     0     0  0\n1 1 0 0    0    0    0    0    0  0    0    0    0    0  0     0     G     0     0  0\n1 1 0 1    0    0    0    0    0  0    0    0    0    0  0     0     0     G     0  0\n1 1 1 0    0    0    0    0    0  0    0    0    0    0  0     0     0     0     G  0\n1 1 1 1    0    0    0    0    0  0    0    0    0    0  0     0     0     0     0  G
TEXT 1360 2400 Left 2 ;A
TEXT 1776 1896 Left 2 ;Q11=GAB'CD
TEXT 1792 1824 Left 2 ;Q10=GAB'CD'
TEXT 1776 1736 Left 2 ;Q9=GAB'C'D
TEXT 1792 1664 Left 2 ;Q8=GAB'C'D'
TEXT 1776 2216 Left 2 ;Q15=GABCD
TEXT 1792 2144 Left 2 ;Q14=GABCD'
TEXT 1776 2056 Left 2 ;Q13=GABC'D
TEXT 1792 1984 Left 2 ;Q12=GABC'D'
RECTANGLE Normal 1888 416 1552 16 2
RECTANGLE Normal 3408 784 2976 48 2
RECTANGLE Normal 1824 2384 1296 1008 2

The netlist it stands for:
* EBA2009d.asc
A1 N001 N002 N004 N004 N004 0 N003 0 AND
A2 N001 N002 N015 N015 N015 0 N014 0 AND
A3 V1+ 0 0 0 0 N002 0 0 BUF
A4 N001 V1+ N004 N004 N004 0 N021 0 AND
A5 N001 V1+ N015 N015 N015 0 N028 0 AND
A6 N015 0 0 0 0 N004 0 0 BUF
XU1 N003 0 V20+ 0 N005 level3a  ; pins In+ In- V+ V- OUT
R1 N006 N005 1kΩ
D1 N006 0 AOT-2015
V1 V1+ 0 1V
V2 V20+ 0 20V
XU2 N014 0 V20+ 0 N016 level3a  ; pins In+ In- V+ V- OUT
R3 N017 N016 1kΩ
D3 N017 0 AOT-2015
XU3 N021 0 V20+ 0 N022 level3a  ; pins In+ In- V+ V- OUT
R4 N023 N022 1kΩ
D4 N023 0 AOT-2015
XU4 N028 0 V20+ 0 N029 level3a  ; pins In+ In- V+ V- OUT
R5 N030 N029 1kΩ
D5 N030 0 AOT-2015
A18 V1+ 0 0 0 0 0 N001 0 BUF
A7 N007 N008 N010 N013 N013 0 N009 0 AND
A8 N007 N008 N010 V1+ V1+ 0 N018 0 AND
A9 V1+ 0 0 0 0 N008 0 0 BUF
A10 N007 N008 N025 N013 N013 0 N024 0 AND
A11 N007 N008 N025 V1+ V1+ 0 N031 0 AND
A12 N025 0 0 0 0 N010 0 0 BUF
XU5 N009 0 V20+ 0 N011 level3a  ; pins In+ In- V+ V- OUT
R2 N012 N011 1kΩ
D2 N012 0 AOT-2015
XU6 N018 0 V20+ 0 N019 level3a  ; pins In+ In- V+ V- OUT
R6 N020 N019 1kΩ
D6 N020 0 AOT-2015
XU7 N024 0 V20+ 0 N026 level3a  ; pins In+ In- V+ V- OUT
R7 N027 N026 1kΩ
D7 N027 0 AOT-2015
XU8 N031 0 V20+ 0 N032 level3a  ; pins In+ In- V+ V- OUT
R8 N033 N032 1kΩ
D8 N033 0 AOT-2015
A13 V1+ 0 0 0 0 0 N007 0 BUF
A14 N007 V1+ N010 N013 N013 0 N034 0 AND
A15 N007 V1+ N010 V1+ V1+ 0 N037 0 AND
A16 N007 V1+ N025 N013 N013 0 N040 0 AND
A17 N007 V1+ N025 V1+ V1+ 0 N043 0 AND
XU9 N034 0 V20+ 0 N035 level3a  ; pins In+ In- V+ V- OUT
R9 N036 N035 1kΩ
D9 N036 0 AOT-2015
XU10 N037 0 V20+ 0 N038 level3a  ; pins In+ In- V+ V- OUT
R10 N039 N038 1kΩ
D10 N039 0 AOT-2015
XU11 N040 0 V20+ 0 N041 level3a  ; pins In+ In- V+ V- OUT
R11 N042 N041 1kΩ
D11 N042 0 AOT-2015
XU12 N043 0 V20+ 0 N044 level3a  ; pins In+ In- V+ V- OUT
R12 N045 N044 1kΩ
D12 N045 0 AOT-2015
A19 V1+ 0 0 0 0 N013 0 0 BUF
A20 N046 N047 N049 N052 V1+ 0 N048 0 AND
A21 N046 N047 N049 N052 V1+ 0 N053 0 AND
A22 V1+ 0 0 0 0 N049 0 0 BUF
A23 N046 N047 N049 N059 V1+ 0 N056 0 AND
A24 N046 N047 N049 N059 V1+ 0 N060 0 AND
A25 N059 0 0 0 0 N052 0 0 BUF
XU13 N048 0 V20+ 0 N050 level3a  ; pins In+ In- V+ V- OUT
R13 N051 N050 1kΩ
D13 N051 0 AOT-2015
XU14 N053 0 V20+ 0 N054 level3a  ; pins In+ In- V+ V- OUT
R14 N055 N054 1kΩ
D14 N055 0 AOT-2015
XU15 N056 0 V20+ 0 N057 level3a  ; pins In+ In- V+ V- OUT
R15 N058 N057 1kΩ
D15 N058 0 AOT-2015
XU16 N060 0 V20+ 0 N061 level3a  ; pins In+ In- V+ V- OUT
R16 N062 N061 1kΩ
D16 N062 0 AOT-2015
A26 V1+ 0 0 0 0 0 N046 0 BUF
A27 N046 N047 V1+ N052 V1+ 0 N063 0 AND
A28 N046 N047 V1+ N052 V1+ 0 N066 0 AND
A29 N046 N047 V1+ N059 V1+ 0 N069 0 AND
A30 N046 N047 V1+ N059 V1+ 0 N072 0 AND
XU17 N063 0 V20+ 0 N064 level3a  ; pins In+ In- V+ V- OUT
R17 N065 N064 1kΩ
D17 N065 0 AOT-2015
XU18 N066 0 V20+ 0 N067 level3a  ; pins In+ In- V+ V- OUT
R18 N068 N067 1kΩ
D18 N068 0 AOT-2015
XU19 N069 0 V20+ 0 N070 level3a  ; pins In+ In- V+ V- OUT
R19 N071 N070 1kΩ
D19 N071 0 AOT-2015
XU20 N072 0 V20+ 0 N073 level3a  ; pins In+ In- V+ V- OUT
R20 N074 N073 1kΩ
D20 N074 0 AOT-2015
A31 V1+ 0 0 0 0 V1+ 0 0 BUF
A32 V1+ 0 0 0 0 N047 0 0 BUF
A33 N046 V1+ N049 N052 V1+ 0 N075 0 AND
A34 N046 V1+ N049 N052 V1+ 0 N078 0 AND
A35 N046 V1+ N049 N059 V1+ 0 N081 0 AND
A36 N046 V1+ N049 N059 V1+ 0 N084 0 AND
XU21 N075 0 V20+ 0 N076 level3a  ; pins In+ In- V+ V- OUT
R21 N077 N076 1kΩ
D21 N077 0 AOT-2015
XU22 N078 0 V20+ 0 N079 level3a  ; pins In+ In- V+ V- OUT
R22 N080 N079 1kΩ
D22 N080 0 AOT-2015
XU23 N081 0 V20+ 0 N082 level3a  ; pins In+ In- V+ V- OUT
R23 N083 N082 1kΩ
D23 N083 0 AOT-2015
XU24 N084 0 V20+ 0 N085 level3a  ; pins In+ In- V+ V- OUT
R24 N086 N085 1kΩ
D24 N086 0 AOT-2015
A37 N046 V1+ V1+ N052 V1+ 0 N087 0 AND
A38 N046 V1+ V1+ N052 V1+ 0 N090 0 AND
A39 N046 V1+ V1+ N059 V1+ 0 N093 0 AND
A40 N046 V1+ V1+ N059 V1+ 0 N096 0 AND
XU25 N087 0 V20+ 0 N088 level3a  ; pins In+ In- V+ V- OUT
R25 N089 N088 1kΩ
D25 N089 0 AOT-2015
XU26 N090 0 V20+ 0 N091 level3a  ; pins In+ In- V+ V- OUT
R26 N092 N091 1kΩ
D26 N092 0 AOT-2015
XU27 N093 0 V20+ 0 N094 level3a  ; pins In+ In- V+ V- OUT
R27 N095 N094 1kΩ
D27 N095 0 AOT-2015
XU28 N096 0 V20+ 0 N097 level3a  ; pins In+ In- V+ V- OUT
R28 N098 N097 1kΩ
D28 N098 0 AOT-2015
.model D D
.lib standard.dio
* EBA2009d.asc: Multiplexer/seçici ve demultiplexer/dağıtıcı devreler-9d örneği.
* 9.4 • Elektronikte, veri dağıtıcı olarak da bilinen çoklayan, bir adet analog veya dijital giriş sinyalini veri seçiciler
*     vasıtasıyla istenilen çıkış hattına yönlendiren elektronik devrelerdir. Giriş sinyalinin dağıtımı, veri seçiciler adı
*     verilen kontrol hatlarından sağlanır. Çoğaltanda “n” adet veri seçiciler sayısına karşılık 2^n kadar çıkış hattı
*     vardır. Çoğaltanda amaç tek giriş hattı üzerinden taşınan veriyi istenen çıktı hatlarından birine yönlendirmektir.
*     • Birden dörde çoklayan, tek girişe uygulanan veriyi iki adet AB=00-01-10-11 veri seçicinin yönlendirmesi ile
*     çıkıştaki dört farklı Q0-Q1-Q2-Q3 hattan seçilen dağıtıcıya aktaran sayısal devredir. Sağdaki U1 devrede tek
*     G girişten 2 seçici kontrolle (AB=00-01-10-11) çoklu 4 çıkıştan (Q0-Q1-Q2-Q3) birine yönlendirilir (örnekte 10
*      -->Q2) ve Iled2=(19.83V-2.78V)/1kΩ=17mA okur.
*     • Birden sekize çoklayan, tek girişe uygulanan veriyi üç adet ABC=000-001-010-011-100-101-110-111 veri
*     seçicinin yönlendirmesi ile çıkıştaki sekiz farklı Q0-Q1-Q2-Q3-Q4-Q5-Q6-Q7 hattan seçilen dağıtıcıya aktaran
*     sayısal devredir. Sağdaki U5 devrede tek G girişten 3 seçici kontrolle (ABC=000-001-010-011-100-101-110-
*     111) çoklu 8 çıkıştan (Q0-Q1-Q2-Q3-Q4-Q5-Q6-Q7) birine yönlendirilir (örnekte 101-->Q5) ve Iled5=(19.83V
*     -2.78V)/1kΩ=17mA okur.
*     • Birden onaltıya çoklayan, tek girişe uygulanan veriyi dört adet ABCD=0000-0001-0010-0011-0100-0101-
*     0110-0111-1000-1001-1010-1011-1100-1101-1110-1111 veri seçicinin yönlendirmesi ile çıkıştaki onaltı farklı
*     Q0-Q1-Q2-Q3-Q4-Q5-Q6-Q7-Q8-Q9-Q10-Q11-Q12-Q13-Q14-Q15 hattan seçilen dağıtıcıya aktaran sayısal
*     devredir. Sağdaki U13 devrede tek G girişten 4 seçici kontrolle (ABCD=0000-0001-0010-0011-0100-0101-
*     0110-0111-1000-1001-1010-1011-1100-1101-1110-1111) çoklu 16 çıkıştan (Q0-Q1-Q2-Q3-Q4-Q5-Q6-Q7-Q8-
*     Q9-QA-QB-QC-QD-QE-QF) birine yönlendirilir (örnekte 1101-->Q13) ve Iled13=(19.83V-2.78V)/1kΩ=17mA okur.
* 1'e 4 çoklayan
* Doğruluk
* A   B   Q0 Q1 Q2 Q3
* 0    0    G   0   0   0
* 0    1    0   G   0   0
* 1    0    0   0   G   0
* 1    1    0   0   0   G
* A
* 1-2-4 çoklayan
* B
* G
* Q3=GAB
* Q2=GAB'
* Q1=GA'B
* Q0=GA'B'
* 1'e 8 çoklayan
* Doğruluk
* A    B    C   Q0 Q1 Q2 Q3 Q4 Q5 Q6 Q7
* 0    0    0     G    0    0    0    0    0    0    0
* 0    0    1     0    G    0    0    0    0    0    0
* 0    1    0     0    0    G    0    0    0    0    0
* 0    1    1     0    0    0    G    0    0    0    0
* 1    0    0     0    0    0    0    G    0    0    0
* 1    0    1     0    0    0    0    0    G    0    0
* 1    1    0     0    0    0    0    0    0    G    0
* 1    1    1     0    0    0    0    0    0    0    G
* Binary seçici
* Desimal dağıtıcı
* Tek giriş
.tran 100uS startup
* A
* 1-3-8 çoklayan
* B
* G
* Q3=GA'BC
* Q2=GA'BC'
* Q1=GA'B'C
* Q0=GA'B'C'
* Binary seçici
* Desimal dağıtıcı
* Tek giriş
* Q7=GABC
* Q6=GABC'
* Q5=GA'B'C
* Q4=GAB'C'
* C
* A
* 1-3-8 çoklayan
* B
* G
* Q3=GA'B'CD
* Q2=GA'B'CCD'
* Q1=GA'B'C'D
* Q0=GA'B'C'D'
* Tek giriş
* Q7=GA'BCD
* Q6=GA'BCD'
* Q5=G'A'BC'D
* Q4=GA'BC'D'
* C
* 1'e 16 çoklayan
* Doğruluk
* A B C D  Q0 Q1 Q2 Q3 Q4 Q5 Q6 Q7 Q8 Q9 QA QB QC QD QE QF
* 0 0 0 0    G    0    0    0    0  0    0    0    0    0  0     0     0     0     0  0
* 0 0 0 1    0    G    0    0    0  0    0    0    0    0  0     0     0     0     0  0
* 0 0 1 0    0    0    G    0    0  0    0    0    0    0  0     0     0     0     0  0
* 0 0 1 1    0    0    0    G    0  0    0    0    0    0  0     0     0     0     0  0
* 0 1 0 0    0    0    0    0    G  0    0    0    0    0  0     0     0     0     0  0
* 0 1 0 1    0    0    0    0    0  G    0    0    0    0  0     0     0     0     0  0
* 0 1 1 0    0    0    0    0    0  0    G    0    0    0  0     0     0     0     0  0
* 0 1 1 1    0    0    0    0    0  0    0    G    0    0  0     0     0     0     0  0
* 1 0 0 0    0    0    0    0    0  0    0    0    G    0  0     0     0     0     0  0
* 1 0 0 1    0    0    0    0    0  0    0    0    0    G  0     0     0     0     0  0
* 1 0 1 0    0    0    0    0    0  0    0    0    0    0  G     0     0     0     0  0
* 1 0 1 1    0    0    0    0    0  0    0    0    0    0  0     G     0     0     0  0
* 1 1 0 0    0    0    0    0    0  0    0    0    0    0  0     0     G     0     0  0
* 1 1 0 1    0    0    0    0    0  0    0    0    0    0  0     0     0     G     0  0
* 1 1 1 0    0    0    0    0    0  0    0    0    0    0  0     0     0     0     G  0
* 1 1 1 1    0    0    0    0    0  0    0    0    0    0  0     0     0     0     0  G
* A
* Q11=GAB'CD
* Q10=GAB'CD'
* Q9=GAB'C'D
* Q8=GAB'C'D'
* Q15=GABCD
* Q14=GABCD'
* Q13=GABC'D
* Q12=GABC'D'
.backanno
.end